# Altium project Muleta instrumentada.PrjPcb
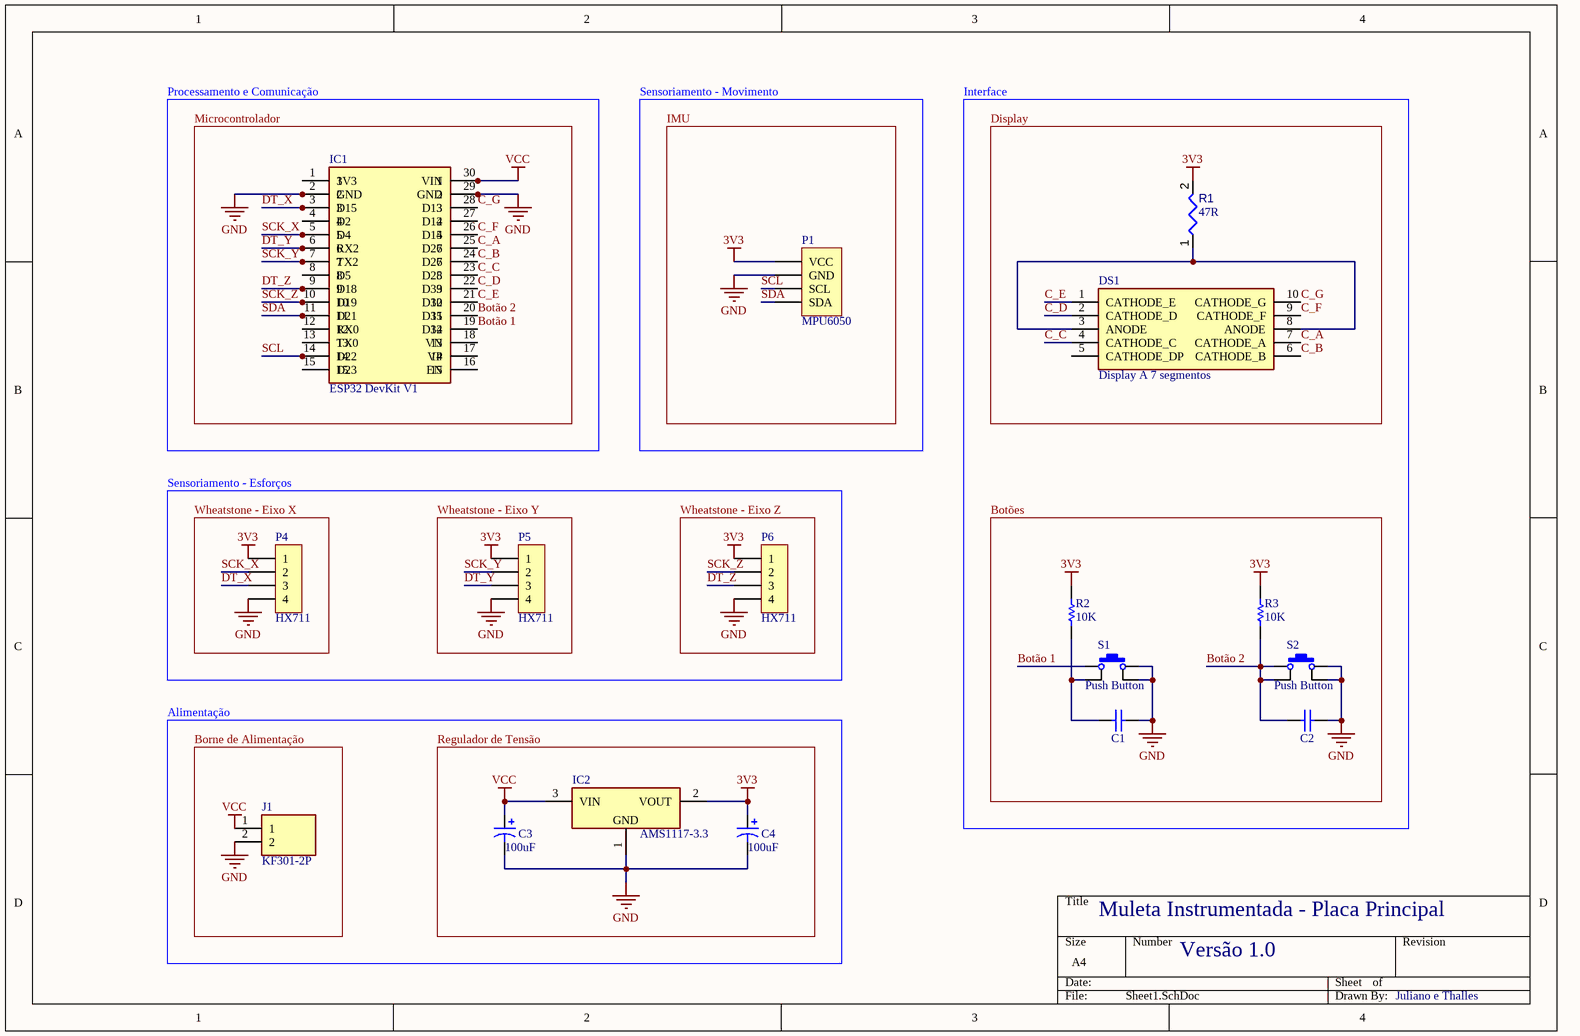
[diagram p0: Sheet1.SchDoc]
CAGE_CODE: ?????; CONTRACT_NUMBER: <CONTRACT NO>; DOC_NO_ASSY_DWG: <ASSY DWG NO>; DOC_NO_BOM: <BOM DOC NO>; DOC_NO_FAB_DWG: <FAB DWG NO>; DOC_NO_SCH_DWG: <SCH DWG NO>; PCB_2_DEC_TOL: +/-.01; PCB_3_DEC_TOL: +/-.010; PCB_ANG_TOL: +/-1/2; PCB_ASSEMBLY_NO: <PCB ASSY NO>; PCB_CHECKER: - -----; PCB_CHECKER_APP_DATE: --/--/----; PCB_DESIGNER: - -----; PCB_DESIGNER_APP_DATE: --/--/----; PCB_DWG_NO: <PCB DWG NO>; PCB_ENGINEER: - -----; PCB_ENGINEER_APP_DATE: --/--/----; PCB_PART_NUMBER: <PCB PN>; PCB_REV: A; SCH_REV: A
1 sheet, 19 parts. Net scope: global (net labels, ports and power ports of the same name join across sheets).
Board file: PCB1.PcbDoc

## Sheet Sheet1.SchDoc
size A4; SheetNumber: 1; SheetTotal: 1

### Parts
C1  CAP CER DISK 100NF 50V  [CAP CER DISK 100NF 50V]  (value not drawn)
C2  CAP CER DISK 100NF 50V  [CAP CER DISK 100NF 50V]  (value not drawn)
C3  100uF  [CAPPRD250W65D630H900]
C4  100uF  [CAPPRD250W65D630H900]
DS1  Display A 7 segmentos  [DIPS1524W51P254L1270H825Q10N]
IC1  ESP32 DevKit V1  [ESP32 DevKit V1]
IC2  AMS1117-3.3  [SOT229P700X180-4N]
J1  KF301-2P  [KF3012P]
P1  MPU6050  [Pin Header 1x8 TH Pitch 2.54mm]
P2  Header Female 1x15  [HDR FEMALE 1x15]  (value not drawn)
P3  Header Female 1x15  [HDR FEMALE 1x15]  (value not drawn)
P4  HX711  [HDR MALE 1x4]
P5  HX711  [HDR MALE 1x4]
P6  HX711  [HDR MALE 1x4]
R1  value 47R  [RESA60-630X240]  (hidden comment: MFR-25FBF52-47R5)
R2  10K  [RESA60-630X240]
R3  10K  [RESA60-630X240]
S1  Push Button  [TACT SWITCH 6X6X7MM]
S2  Push Button  [TACT SWITCH 6X6X7MM]

### Blocks framed on the sheet
Microcontrolador: IC1 P2 P3
IMU: P1
Display: DS1 R1
Wheatstone - Eixo X: P4
Wheatstone - Eixo Y: P5
Wheatstone - Eixo Z: P6
Botões: C1 C2 R2 R3 S1 S2
Borne de Alimentação: J1
Regulador de Tensão: C3 C4 IC2

### Nets
3V3: C4.1 IC2.2(VOUT) P1.1(VCC) P4.1 P5.1 P6.1 R1.2 R2.2 R3.2
GND: C1.2 C2.2 C3.2 C4.2 IC1.2(GND) IC1.29(GND) IC2.1(GND) J1.2 P1.2(GND) P2.2 P3.2 P4.4 P5.4 P6.4 S1.3 S1.4 S2.3 S2.4
VCC: C3.1 IC1.30(VIN) IC2.3(VIN) J1.1 P3.1
Botão 1: IC1.19(D34) P3.12 S1.1
Botão 2: C2.1 IC1.20(D35) P3.11 R3.1 S2.1 S2.2
C_A: DS1.7(CATHODE_A) IC1.25(D27) P3.6
C_B: DS1.6(CATHODE_B) IC1.24(D26) P3.7
C_C: DS1.4(CATHODE_C) IC1.23(D25) P3.8
C_D: DS1.2(CATHODE_D) IC1.22(D33) P3.9
C_E: DS1.1(CATHODE_E) IC1.21(D32) P3.10
C_F: DS1.9(CATHODE_F) IC1.26(D14) P3.5
C_G: DS1.10(CATHODE_G) IC1.28(D13) P3.3
DT_X: IC1.3(D15) P2.3 P4.3
DT_Y: IC1.6(RX2) P2.6 P5.3
DT_Z: IC1.9(D18) P2.9 P6.3
SCK_X: IC1.5(D4) P2.5 P4.2
SCK_Y: IC1.7(TX2) P2.7 P5.2
SCK_Z: IC1.10(D19) P2.10 P6.2
SCL: IC1.14(D22) P1.3(SCL) P2.14
SDA: IC1.11(D21) P1.4(SDA) P2.11
NetC1_1: C1.1 R2.1 S1.2
NetDS1_3: DS1.3(ANODE) DS1.8(ANODE) R1.1
NetIC1_1: IC1.1(3V3) P2.1
NetIC1_4: IC1.4(D2) P2.4
NetIC1_8: IC1.8(D5) P2.8
NetIC1_12: IC1.12(RX0) P2.12
NetIC1_13: IC1.13(TX0) P2.13
NetIC1_15: IC1.15(D23) P2.15
NetIC1_16: IC1.16(EN) P3.15
NetIC1_17: IC1.17(VP) P3.14
NetIC1_18: IC1.18(VN) P3.13
NetIC1_27: IC1.27(D12) P3.4

Not connected (* = marked no-connect by the designer): DS1 5(CATHODE_DP)

### Notes on the sheet
- Processamento e Comunicação
- Sensoriamento - Movimento
- Interface
- Sensoriamento - Esforços
- Alimentação
- Muleta Instrumentada - Placa Principal
- Versão 1.0
- Juliano e Thalles

### Library data of the parts
C1 C2 = CMP-018-000011-1: Manufacturer Part Number: IMP14925; Product Range: MCFY Series; Capacitance Tolerance: +80%, -20%; Voltage Rating: 50; Capacitor Terminals: Radial Leaded; SVHC: No SVHC (15-Jun-2015); Capacitance: 0.1uF; Dielectric Characteristic: Y5; Design Item ID: CAP CER DISK 100NF 50V; Source: Capacitores_SCHLIB.SchLib; ComponentLink1Description: http://loja.multcomercial.com.br/capacitor-ceramico-disco-100kpf-50v-104-100k-100nf-0-1uf-cod-1351.html; RoHS: YES; Manufacturer: -; Packaging: Each; Operating Temperature Min: -25; ComponentLink1URL: http://loja.multcomercial.com.br/capacitor-ceramico-disco-100kpf-50v-104-100k-100nf-0-1uf-cod-1351.html; Lead Spacing: 5; Operating Temperature Max: 85; Operating Temperature Range: -25°C to +85°C<!--FANDB--><div class="features-and-benefits-container"><div class="features-and-benefits-description"><span class="features-benefits-value">The MCFY series from Multicomp are radial leaded ceramic disc capacitors. The capacitance values ranges from 6800pF to 0.22?F.</span></div><div class="features-and-benefits-list"><ul class="features-and-benefits-list-list"><li class="features-and-benefits-list-item">Large capacitance in small size</li><li class="features-and-benefits-list-item">Rated voltage of 50V</li><li class="features-and-benefits-list-item">80%/-20% tolerance</li><li class="features-and-benefits-list-item">Operating temperature range -25°C to +85; Capacitance Tolerance ±: +80%, -20%; Stock 1: 115809; Pricing 1: 1=0.10 (BRL)
C3 C4 = 16SEPC100MW+S: Capacitor Polarised; Manufacturer_Name: Panasonic; Datasheet Link: http://industrial.panasonic.com/www-cgi/jvcr13pz.cgi?E+CI+4+AAB8010+16SEPC100MW+8+WW; Height: 9mm; Manufacturer_Part_Number: 16SEPC100MW+S; Mouser Part Number: 667-16SEPC100MW+S; Mouser Price/Stock: https://www.mouser.co.uk/ProductDetail/Panasonic/16SEPC100MW%2bS?qs=OE1iw1LrrPGijFXueDJbGQ%3D%3D; Arrow Part Number: 16SEPC100MW+S; Arrow Price/Stock: https://www.arrow.com/en/products/16sepc100mws/panasonic
DS1 = C-551SRD-NW_B_W: Display; Manufacturer_Name: Para Light Electronics; Manufacturer_Part_Number: C-551SRD-NW B/W; Datasheet Link: http://akizukidenshi.com/download/ds/paralight/C-551SRD.pdf; Height: 8.25mm
IC2 = AMS1117-3.3: Integrated Circuit; Manufacturer_Name: Advanced Monolithic Systems; Datasheet Link: http://www.advanced-monolithic.com/pdf/ds1117.pdf; Height: 1.8mm; Manufacturer_Part_Number: AMS1117-3.3
J1 = KF301-2P: Connector; Manufacturer_Name: Handson Technology; Datasheet Link: http://www.handsontec.com/dataspecs/terminal%20block-5mm.pdf; Height: 10mm; Manufacturer_Part_Number: KF301-2P
P1 = MPU6050 module: Headers & Wire Housings 36Pin 2mm Spacing Single Row Hdrs, 5pc; Design Item ID: Header Male 1x8; Source: Conectores_SCHLIB.SchLib
P2 P3 = Header Female 1x15: Headers & Wire Housings 40Pin 2mm Spacing Single Row Hdrs, 5pc; Manufacturer: Cromax; Mounting Angle: Vertical; Number of Positions: 40 Position; Supplier 1: -; Manufacturer Part Number: -; RoHS: RoHS Compliant; Category: Headers & Wire Housings; Stock 1: 14; Pricing 1: 1=1.60, 5=0.32 (BRL); Accessory Type: -; Contact Plating: Gold; Contact Type: -; Number of Rows: 1 Row; Product: Headers; Termination Style: Through Hole; Type: Breakaway; Brand: Cromax; Mounting Style: Straight Pin; Pitch: 2 mm; Row Spacing: -; Contact Gender: Pin (Female); Product Category: Accessories; RoHS - Mouser: Y; Minimum Order Quantity: 1; Reeling: False; ComponentLink1URL: -; ComponentLink1Description: -; Supplier Part Number 1: -
P4-P6 = Header 1x4: Headers & Wire Housings 40Pin 2mm Spacing Single Row Hdrs, 5pc; Manufacturer: Cromax; Manufacturer Part Number: IMP10327; Mounting Angle: Vertical; Number of Positions: 40 Position; Supplier 1: Mult Comercial; RoHS: RoHS Compliant; Category: Headers & Wire Housings; Stock 1: 14; Pricing 1: 1=1.00, 5=0.20 (BRL); Accessory Type: -; Contact Plating: Gold; Contact Type: -; Number of Rows: 1 Row; Product: Headers; Termination Style: Through Hole; Type: Breakaway; Brand: Cromax; Mounting Style: Straight Pin; Pitch: 2 mm; Row Spacing: -; Contact Gender: Pin (Male); Product Category: Accessories; RoHS - Mouser: Y; Minimum Order Quantity: 1; Reeling: False; ComponentLink1URL: http://loja.multcomercial.com.br/barra-de-pinos-simples-1x40-macho-bmo40-1e.html; ComponentLink1Description: http://loja.multcomercial.com.br/barra-de-pinos-simples-1x40-macho-bmo40-1e.html; Supplier Part Number 1: Barra de Pinos Simples 1x40 Macho BMO40-1E
R1 = CMP-009-00058-3: Axial Resistor, 47.5 Ohm, +/- 1%, 0.25 W, -55 to 155 degC, 2-Pin THD, RoHS, Bulk; Manufacturer: Yageo; Power: 250mW; Voltage Rating: 250V; Case/Package: Axial; Manufacturer URL: http://www.yageo.com/; Tolerance: 1%; Datasheet Version: Apr-13; Package Description: 2-Pin Axial Lead, Dia 2.4 mm, Body Length 6.3 mm; Min Operating Temperature: -55°C; RoHS Compliant: True; Package Quantity: 200; Mounting Technology: TH; Datasheet URL: http://www.yageo.com/documents/recent/Yageo%20LR_MFR_2013.pdf; Max Operating Temperature: 155°C; Packaging: Bulk; Package Reference: MFR-25
R2 R3 = CMP-009-00047-1: Axial Resistor, 10 KOhm, +/- 1%, 0.25 W, -55 to 155 degC, 2-Pin THD, RoHS, Bulk; Manufacturer: Yageo; Voltage Rating: 250V; Power: 250mW; RoHS Compliant: True; Max Operating Temperature: 155°C; Package Reference: MFR-25; Package Quantity: 200; Manufacturer URL: http://www.yageo.com/; Tolerance: 1%; Datasheet URL: http://www.yageo.com/documents/recent/Yageo%20LR_MFR_2013.pdf; Resistance: 10k; Mounting Technology: TH; Datasheet Version: Apr-13; Packaging: Bulk; Package Description: 2-Pin Axial Lead, Dia 2.4 mm, Body Length 6.3 mm; Case/Package: Axial; Min Operating Temperature: -55°C
S1 S2 = CMP-022-000000-1: SWITCH TACTILE SPST-NO 0.02A 15V; Manufacturer: Panasonic Electronic Components; Manufacturer Part Number: EVQ-PAC07K; Actuator Height off PCB, from Pins: 7.00mm; Contact Rating @ Voltage: 0.02A @ 15VDC; Switch Travel: 0.25mm; Actuator Orientation: Top Actuated; Operating Force: 100gf; Mechanical Life: 100,000 Cycles; Illumination: Non-Illuminated; Outline: 6.00mm x 6.00mm; Actuator Type: Standard; Switch Function: Off-Mom; Stock 1: 19805; RoHS: RoHS Compliant; ComponentLink1Description: http://industrial.panasonic.com/cdbs/www-data/pdf/ATK0000/ATK0000CE10.pdf; Category: Switches; ComponentLink1URL: http://industrial.panasonic.com/cdbs/www-data/pdf/ATK0000/ATK0000CE10.pdf; Actuator Material: -; Design Item ID: SWITCH TACTILE SPST-NO 0.02A 15V; Packaging: Bulk; Ingress Protection: -; Termination Style: PC Pin; Illumination Type, Color: -; Features: -; Operating Temperature: -20°C ~ 70°C; Circuit: SPST-NO; Mounting Type: Through Hole; Source: Conectores_SCHLIB.SchLib; Illumination Voltage (Nominal): -; Part Status: Active; Pricing 1: 1=0.27, 10=0.254, 25=0.2168, 50=0.1896, 100=0.176, 250=0.15572, 500=0.14894, 1000=0.12186, 5000=0.10832 (USD)